# Altium schematic sheet DVT-Atlas-Driver1.SchDoc: DVT Atlas Driver
size A4; PartNumber: PN0044; Drawn By: Sebastian Kulik
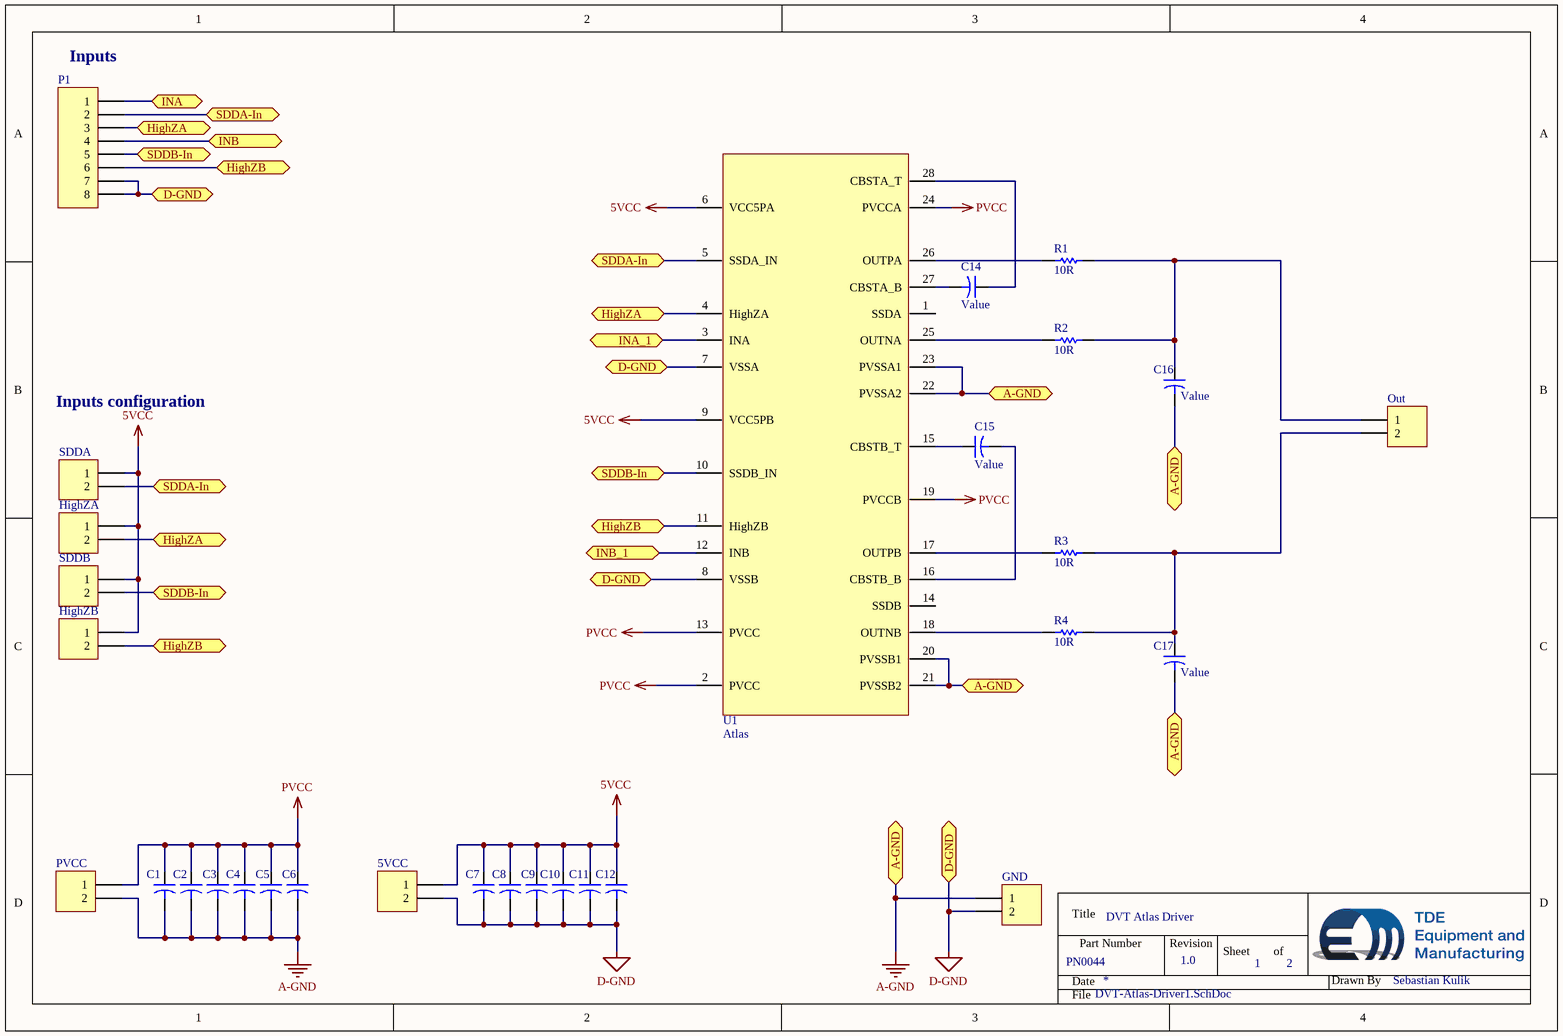
[diagram p0: DVT-Atlas-Driver1.SchDoc]

## Parts
5VCC  PHOENIX_1715721  [Phoenix-2-5_08]  (value not drawn)
*  Om  [Om-5mm]  (value not drawn)
+  Om  [Om-5mm]  (value not drawn)
C1  Capacitor-Dummy-THT  [Dummy-10mm]  (value not drawn)
C2  Capacitor-Dummy-THT  [KEMET-C052H]  (value not drawn)
C3  Capacitor-Dummy-THT  [KEMET-C052H]  (value not drawn)
C4  Capacitor-Dummy-THT  [KEMET-C052H]  (value not drawn)
C5  Capacitor-Dummy-THT  [KEMET-C052H]  (value not drawn)
C6  Capacitor-Dummy-THT  [KEMET-C052H]  (value not drawn)
C7  Capacitor-Dummy-THT  [KEMET-C052H]  (value not drawn)
C8  Capacitor-Dummy-THT  [Dummy-10mm]  (value not drawn)
C9  Capacitor-Dummy-THT  [KEMET-C052H]  (value not drawn)
C10  Capacitor-Dummy-THT  [KEMET-C052H]  (value not drawn)
C11  Capacitor-Dummy-THT  [KEMET-C052H]  (value not drawn)
C12  Capacitor-Dummy-THT  [KEMET-C052H]  (value not drawn)
C14  Capacitor-Dummy-THT  [KEMET-C052H]  (value not drawn)
C15  Capacitor-Dummy-THT  [KEMET-C052H]  (value not drawn)
C16  Capacitor-Dummy-THT  [KEMET-C052H]  (value not drawn)
C17  Capacitor-Dummy-THT  [KEMET-C052H]  (value not drawn)
GND  PHOENIX_1715721  [Phoenix-2-5_08]  (value not drawn)
HighZA  Plug_2_180_2.54  [HDR1X2]  (value not drawn)
HighZB  Plug_2_180_2.54  [HDR1X2]  (value not drawn)
Out  PHOENIX_1715721  [Phoenix-2-5_08]  (value not drawn)
P1  Plug_08_2.54  [HDR1X8_2.54]  (value not drawn)
PVCC  PHOENIX_1715721  [Phoenix-2-5_08]  (value not drawn)
R1  value 10R  [Dummy-10mm]  (hidden comment: 10R_10mm-HT-THT)
R2  value 10R  [Dummy-10mm]  (hidden comment: 10R_10mm-HT-THT)
R3  value 10R  [Dummy-10mm]  (hidden comment: 10R_10mm-HT-THT)
R4  value 10R  [Dummy-10mm]  (hidden comment: 10R_10mm-HT-THT)
SDDA  Plug_2_180_2.54  [HDR1X2]  (value not drawn)
SDDB  Plug_2_180_2.54  [HDR1X2]  (value not drawn)
U1  Atlas  [SOIC28]

## Ports
A-GND, D-GND, HighZA, HighZB, INA, INA_1, INB, INB_1, SDDA-In, SDDB-In

## Nets
5VCC: 5VCC.1 C7.1 C8.1 C9.1 C10.1 C11.1 C12.1 HighZA.1 HighZB.1 SDDA.1 SDDB.1 U1.6(VCC5PA) U1.9(VCC5PB)
A-GND: C1.2 C2.2 C3.2 C4.2 C5.2 C6.2 C16.2 C17.2 GND.1 PVCC.2 U1.20(PVSSB1) U1.21(PVSSB2) U1.22(PVSSA2) U1.23(PVSSA1) ; port A-GND
D-GND: 5VCC.2 C7.2 C8.2 C9.2 C10.2 C11.2 C12.2 GND.2 P1.7 P1.8 U1.7(VSSA) U1.8(VSSB) ; port D-GND
PVCC: C1.1 C2.1 C3.1 C4.1 C5.1 C6.1 PVCC.1 U1.2(PVCC) U1.13(PVCC) U1.19(PVCCB) U1.24(PVCCA)
HighZA: HighZA.2 P1.3 U1.4(HighZA) ; port HighZA
HighZB: HighZB.2 P1.6 U1.11(HighZB) ; port HighZB
INA: P1.1 ; port INA
INA_1: U1.3(INA) ; port INA_1
INB: P1.4 ; port INB
INB_1: U1.12(INB) ; port INB_1
SDDA-In: P1.2 SDDA.2 U1.5(SSDA_IN) ; port SDDA-In
SDDB-In: P1.5 SDDB.2 U1.10(SSDB_IN) ; port SDDB-In
NetC14_1: C14.1 U1.28(CBSTA_T)
NetC14_2: C14.2 U1.27(CBSTA_B)
NetC15_1: C15.1 U1.15(CBSTB_T)
NetC15_2: C15.2 U1.16(CBSTB_B)
NetC16_1: C16.1 Out.1 R1.2 R2.2
NetC17_1: C17.1 Out.2 R3.2 R4.2
NetR1_1: R1.1 U1.26(OUTPA)
NetR2_1: R2.1 U1.25(OUTNA)
NetR3_1: R3.1 U1.17(OUTPB)
NetR4_1: R4.1 U1.18(OUTNB)

Not connected (* = marked no-connect by the designer): U1 1(SSDA) 14(SSDB)

## Notes on the sheet
- (near P1) Inputs
- Inputs configuration
- 1.0
- 1
- 2
- Title
- Date
- Part Number
- Revision
- Sheet
- of
- Drawn By
- File

## Library data of the parts
5VCC GND Out PVCC = 2Pol_1715721: Phoenix, 2 pol, 5.08mm, 22A, 715721; Deliverer PartNr: 3041529; Deliverer: Farnell; TDE-PN: CON0008; LatestRevisionDate: 02.05.2014; LatestRevisionNote: Re-released for DXP Platform.; Publisher: Sebastian Kulik; Manufacturer PartNr: 1715721; Manufacturer: Phoenix; PackageDescription: Phoenix-2-5_08
HighZA HighZB SDDA SDDB = Plug_2_180_2.54: Plug, 2-Pin; Manufacturer PartNr: 61300211121; Manufacturer: WE; Deliverer PartNr: 828-1581; Deliverer: RS; TDE-PN: CON0010; LatestRevisionDate: 14.05.2014; LatestRevisionNote: Re-released for DXP Platform.; Publisher: Sebastian Kulik; Price: 0.118/5
P1 = Plug_08_2.54: Plug, 08-Pin; Manufacturer PartNr: 61300811121; Manufacturer: WE; Deliverer PartNr: 828-1604; Deliverer: RS; TDE-PN: CON0035; LatestRevisionDate: 11.11.2014; LatestRevisionNote: Re-released for DXP Platform.; Publisher: Sebastian Kulik; Price: 0.346/5
R1-R4 = 10R_10mm-HT-THT: Vishay RN60 series,175°C ,250mW, 1%; Manufacturer PartNr: RN60D10R0FB14; Deliverer PartNr: 830-7558; TDE-PN: R0080; Deliverer: RS; Published: 27.10.2014; Publisher: Sebastian Kulik; PackageDescription: 1206; Manufacturer: Vishay; Price: 0.11/1; Part Description: Vishay RN60 series,175°C ,250mW, 1%
U1 = CHT_TIT3345E_CSOIC28_T: Gate driver, 30V, HT; Deliverer PartNr: CHT-TIT3345E-CSOIC28-T; Manufacturer: CISSOID; Deliverer: Future; TDE-PN: IC0075; Published: 12.05.2016; PackageDescription: SOIC28; Publisher: Sebastian Kulik; Manufacturer PartNr: CHT-TIT3345E-CSOIC28-T; Price: 481.89
C1-C12 C14-C17 = Capacitor-Dummy-THT: Published: 08.12.2015; Part Description: Capacitor-Dummy-THT; Publisher: Sebastian Kulik; PackageDescription: -; Deliverer: -; Deliverer PartNr: -; Manufacturer: -; Manufacturer PartNr: -; TDE-PN: -; Value: Value; Price: *